# EAGLE schematic micromouse (EAGLE 9.6.2)
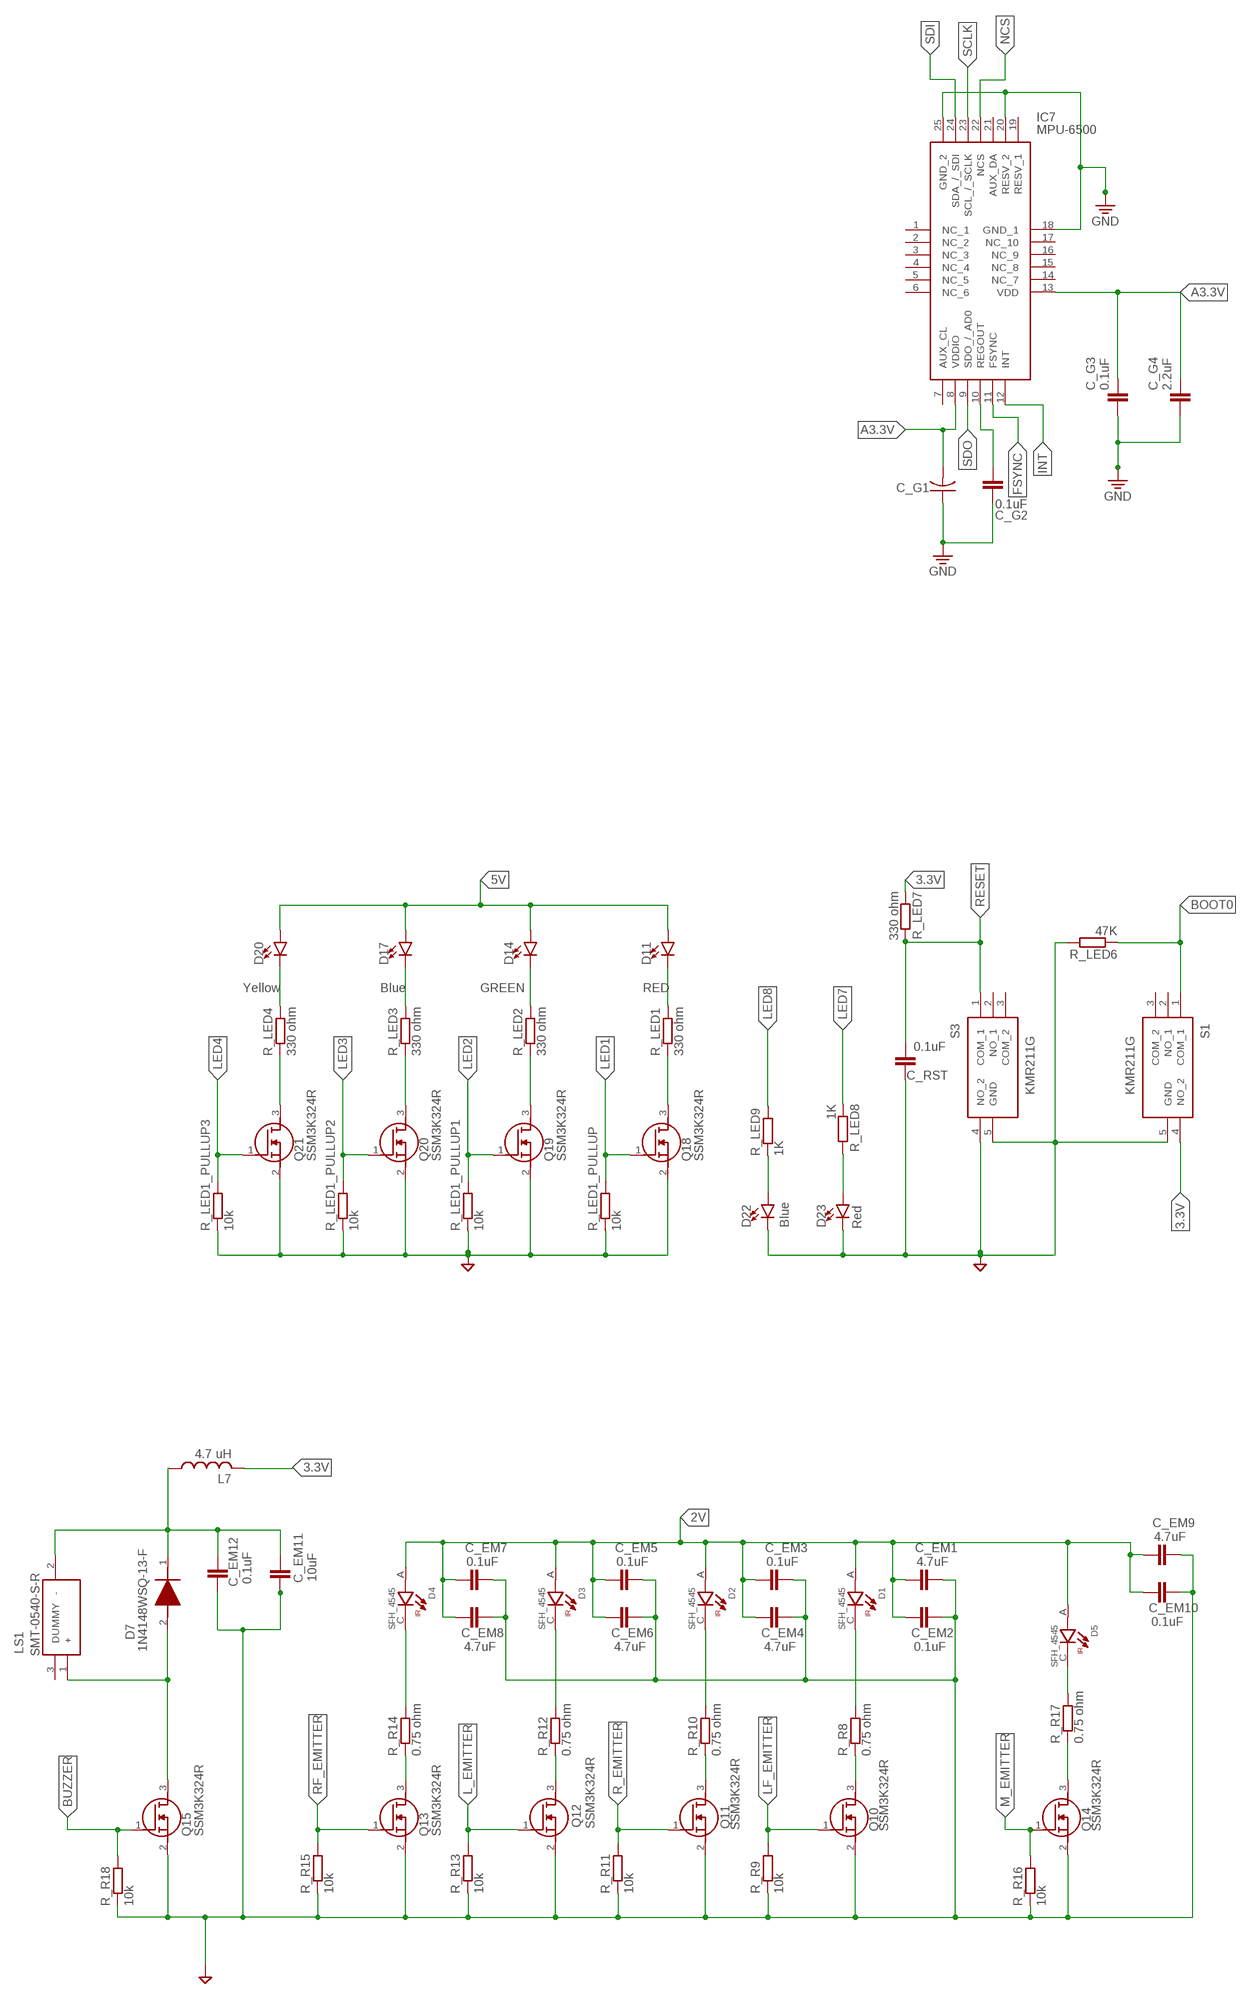
[diagram p0: schematic, sheet 1, part 1 of 2]
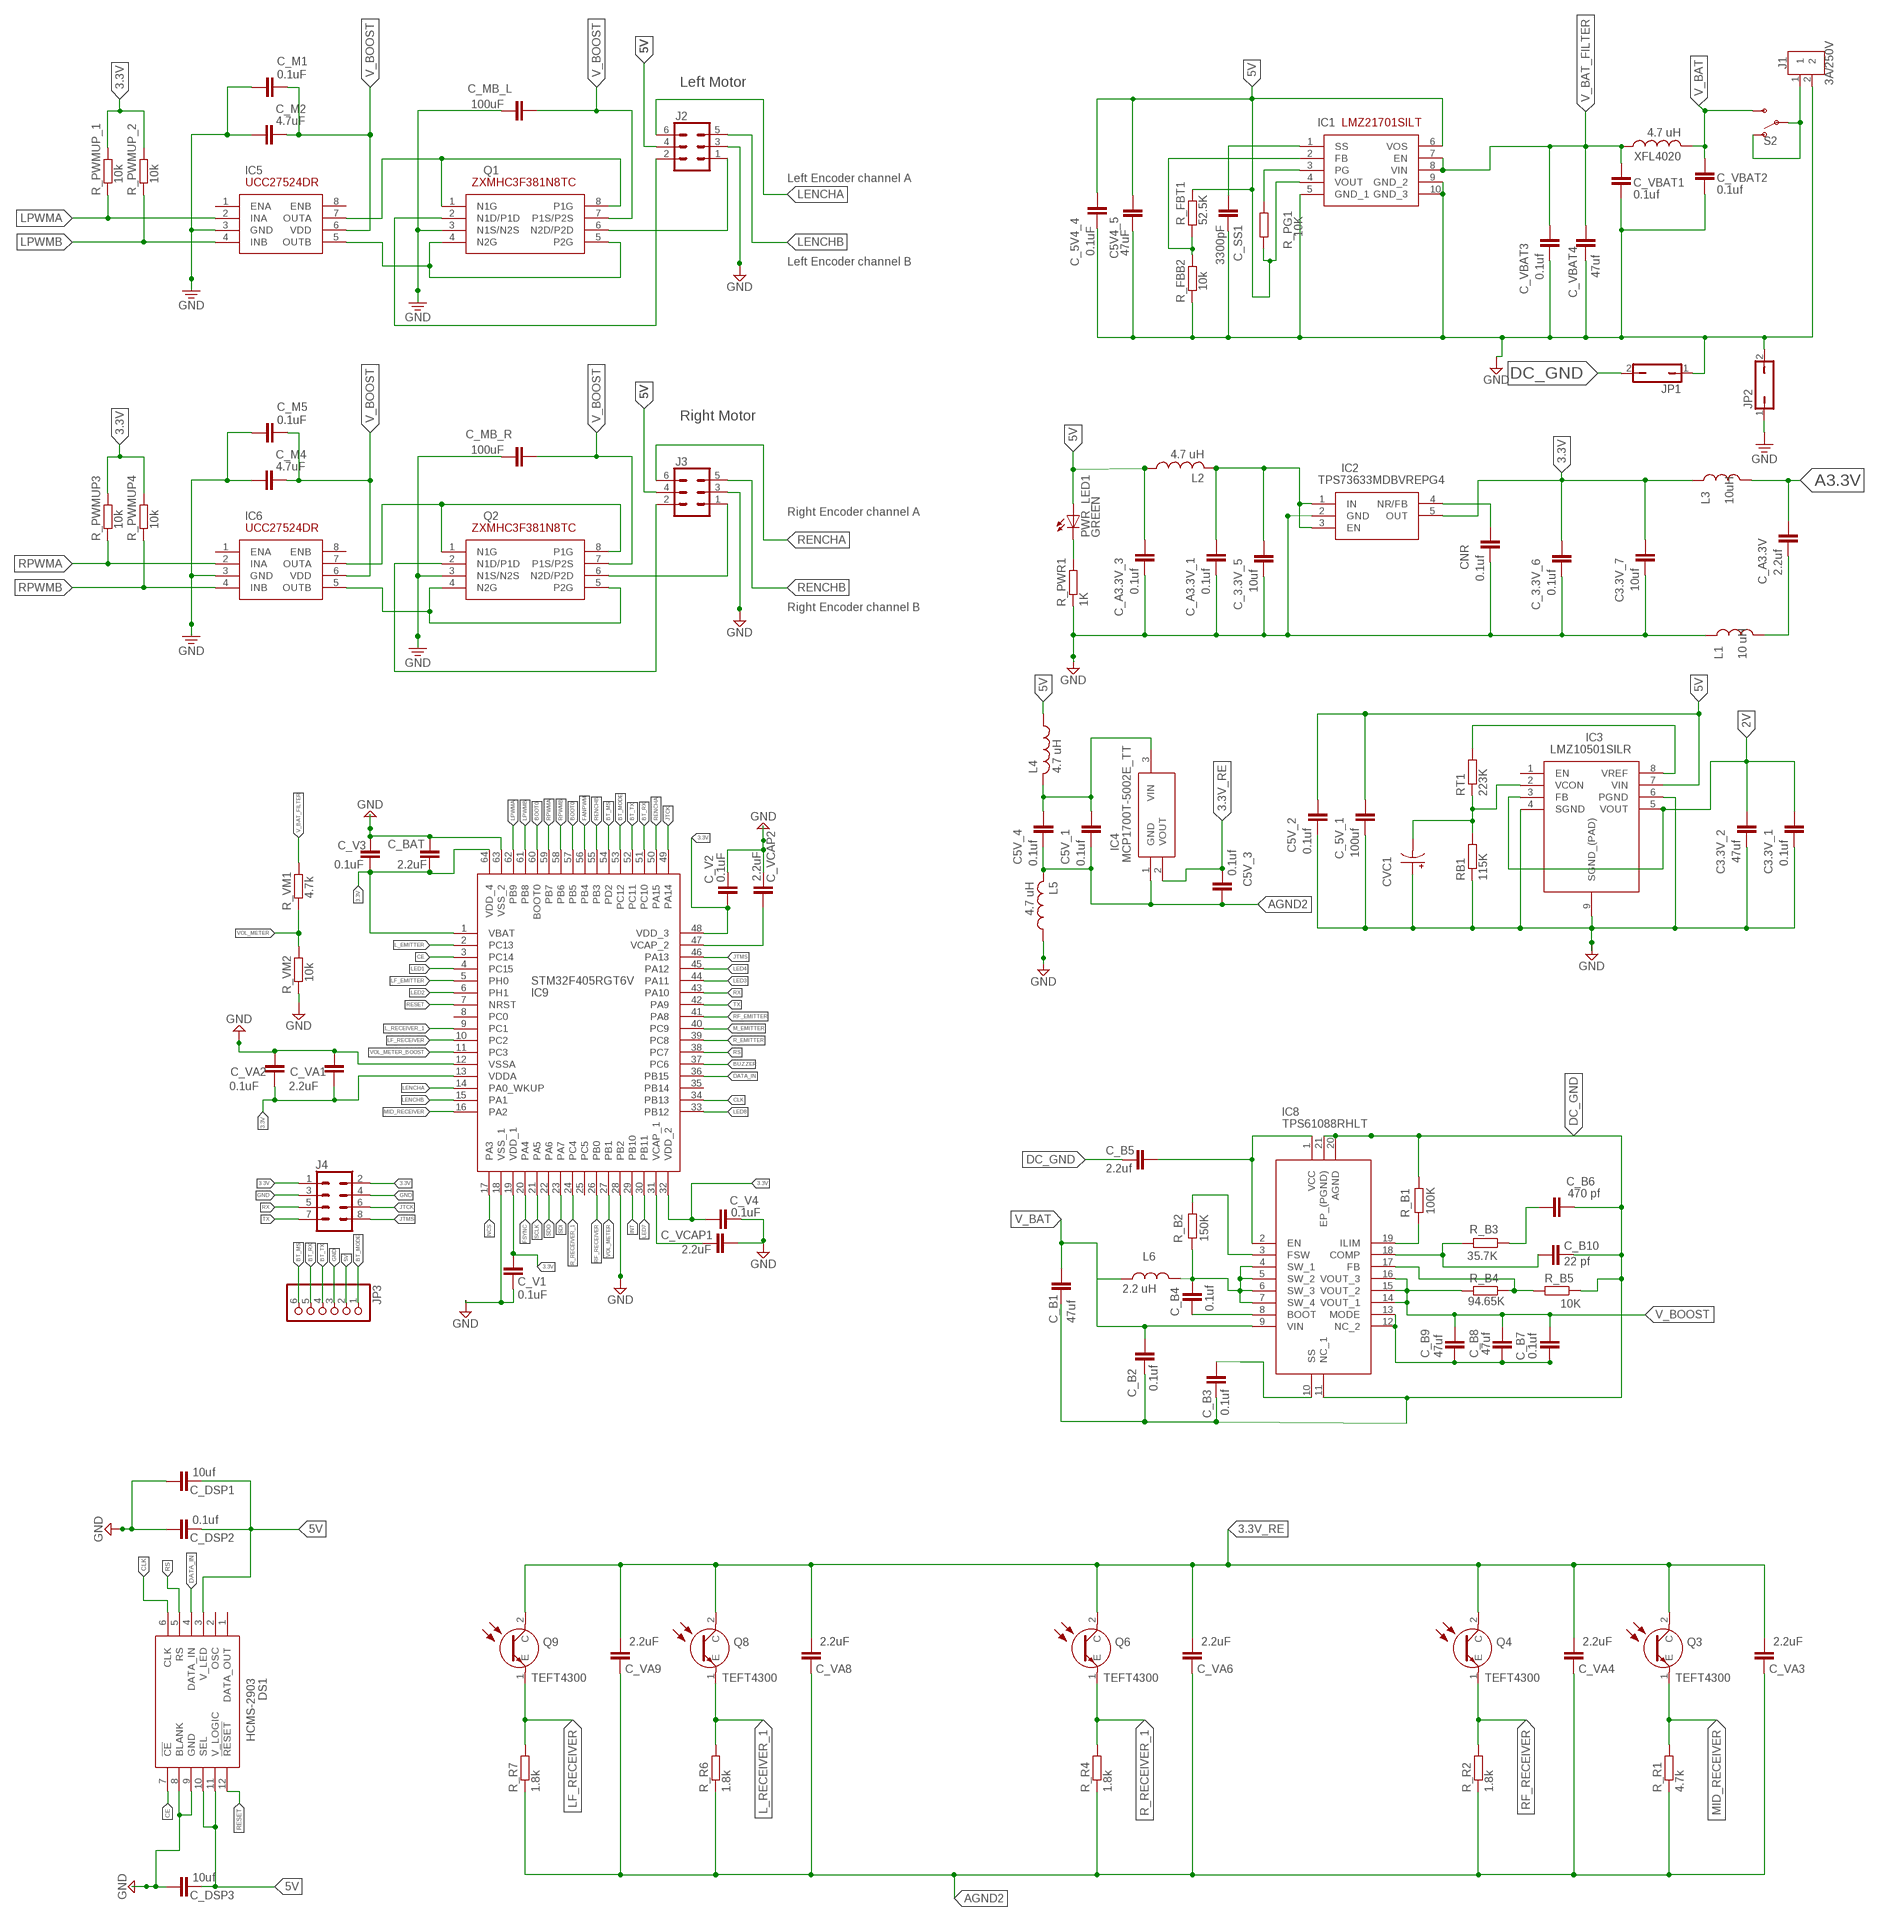
[diagram p1: schematic, sheet 1, part 2 of 2]

## Parts
C3.3V_1  0.1uf  C_CHIP-0805(2012-METRIC)  [CAPC2012X110]
C3.3V_2  47uf  C_CHIP-0805(2012-METRIC)  [CAPC2012X110]
C3.3V_7  10uf  C_CHIP-0805(2012-METRIC)  [CAPC2012X110]
C5V4_5  47uF  C_CHIP-0805(2012-METRIC)  [CAPC2012X110]
C5V_1  0.1uf  C_CHIP-0805(2012-METRIC)  [CAPC2012X110]
C5V_2  0.1uf  C_CHIP-0805(2012-METRIC)  [CAPC2012X110]
C5V_3  0.1uf  C_CHIP-0805(2012-METRIC)  [CAPC2012X110]
C5V_4  0.1uf  C_CHIP-0805(2012-METRIC)  [CAPC2012X110]
C_3.3V_5  10uf  C_CHIP-0805(2012-METRIC)  [CAPC2012X110]
C_3.3V_6  0.1uf  C_CHIP-0805(2012-METRIC)  [CAPC2012X110]
C_5V4_4  0.1uF  C_CHIP-0805(2012-METRIC)  [CAPC2012X110]
C_5V_1  100uf  C_CHIP-0805(2012-METRIC)  [CAPC2012X110]
C_A3.3V  2.2uf  C_CHIP-0805(2012-METRIC)  [CAPC2012X110]
C_A3.3V_1  0.1uf  C_CHIP-0805(2012-METRIC)  [CAPC2012X110]
C_A3.3V_3  0.1uf  C_CHIP-0805(2012-METRIC)  [CAPC2012X110]
C_B1  47uf  C_CHIP-0805(2012-METRIC)  [CAPC2012X110]
C_B2  0.1uf  C_CHIP-0805(2012-METRIC)  [CAPC2012X110]
C_B3  0.1uf  C_CHIP-0805(2012-METRIC)  [CAPC2012X110]
C_B4  0.1uf  C_CHIP-0805(2012-METRIC)  [CAPC2012X110]
C_B5  2.2uf  C_CHIP-0805(2012-METRIC)  [CAPC2012X110]
C_B6  470 pf  C_CHIP-0805(2012-METRIC)  [CAPC2012X110]
C_B7  0.1uf  C_CHIP-0805(2012-METRIC)  [CAPC2012X110]
C_B8  47uf  C_CHIP-0805(2012-METRIC)  [CAPC2012X110]
C_B9  47uf  C_CHIP-0805(2012-METRIC)  [CAPC2012X110]
C_B10  22 pf  C_CHIP-0805(2012-METRIC)  [CAPC2012X110]
C_BAT  2.2uF  C_CHIP-0805(2012-METRIC)  [CAPC2012X110]
C_DSP1  10uf  C_CHIP-0805(2012-METRIC)  [CAPC2012X110]
C_DSP2  0.1uf  C_CHIP-0805(2012-METRIC)  [CAPC2012X110]
C_DSP3  10uf  C_CHIP-0805(2012-METRIC)  [CAPC2012X110]
C_EM1  4.7uF  C_CHIP-0805(2012-METRIC)  [CAPC2012X110]
C_EM2  0.1uF  C_CHIP-0805(2012-METRIC)  [CAPC2012X110]
C_EM3  0.1uF  C_CHIP-0805(2012-METRIC)  [CAPC2012X110]
C_EM4  4.7uF  C_CHIP-0805(2012-METRIC)  [CAPC2012X110]
C_EM5  0.1uF  C_CHIP-0805(2012-METRIC)  [CAPC2012X110]
C_EM6  4.7uF  C_CHIP-0805(2012-METRIC)  [CAPC2012X110]
C_EM7  0.1uF  C_CHIP-0805(2012-METRIC)  [CAPC2012X110]
C_EM8  4.7uF  C_CHIP-0805(2012-METRIC)  [CAPC2012X110]
C_EM9  4.7uF  C_CHIP-0805(2012-METRIC)  [CAPC2012X110]
C_EM10  0.1uF  C_CHIP-0805(2012-METRIC)  [CAPC2012X110]
C_EM11  10uF  C_CHIP-0805(2012-METRIC)  [CAPC2012X110]
C_EM12  0.1uF  C_CHIP-0805(2012-METRIC)  [CAPC2012X110]
C_G1  0.01uF  C-USC0603K  [C0603K]
C_G2  0.1uF  C_CHIP-0805(2012-METRIC)  [CAPC2012X110]
C_G3  0.1uF  C_CHIP-0805(2012-METRIC)  [CAPC2012X110]
C_G4  2.2uF  C_CHIP-0805(2012-METRIC)  [CAPC2012X110]
C_M1  0.1uF  C_CHIP-0805(2012-METRIC)  [CAPC2012X110]
C_M2  4.7uF  C_CHIP-0805(2012-METRIC)  [CAPC2012X110]
C_M4  4.7uF  C_CHIP-0805(2012-METRIC)  [CAPC2012X110]
C_M5  0.1uF  C_CHIP-0805(2012-METRIC)  [CAPC2012X110]
C_MB_L  100uF  C_CHIP-0805(2012-METRIC)  [CAPC2012X110]
C_MB_R  100uF  C_CHIP-0805(2012-METRIC)  [CAPC2012X110]
C_RST  0.1uF  C_CHIP-0805(2012-METRIC)  [CAPC2012X110]
C_SS1  3300pF  C_CHIP-0805(2012-METRIC)  [CAPC2012X110]
C_V1  0.1uF  C_CHIP-0805(2012-METRIC)  [CAPC2012X110]
C_V2  0.1uF  C_CHIP-0805(2012-METRIC)  [CAPC2012X110]
C_V3  0.1uF  C_CHIP-0805(2012-METRIC)  [CAPC2012X110]
C_V4  0.1uF  C_CHIP-0805(2012-METRIC)  [CAPC2012X110]
C_VA1  2.2uF  C_CHIP-0805(2012-METRIC)  [CAPC2012X110]
C_VA2  0.1uF  C_CHIP-0805(2012-METRIC)  [CAPC2012X110]
C_VA3  2.2uF  C_CHIP-0805(2012-METRIC)  [CAPC2012X110]
C_VA4  2.2uF  C_CHIP-0805(2012-METRIC)  [CAPC2012X110]
C_VA6  2.2uF  C_CHIP-0805(2012-METRIC)  [CAPC2012X110]
C_VA8  2.2uF  C_CHIP-0805(2012-METRIC)  [CAPC2012X110]
C_VA9  2.2uF  C_CHIP-0805(2012-METRIC)  [CAPC2012X110]
C_VBAT1  0.1uf  C_CHIP-0805(2012-METRIC)  [CAPC2012X110]
C_VBAT2  0.1uf  C_CHIP-0805(2012-METRIC)  [CAPC2012X110]
C_VBAT3  0.1uf  C_CHIP-0805(2012-METRIC)  [CAPC2012X110]
C_VBAT4  47uf  C_CHIP-0805(2012-METRIC)  [CAPC2012X110]
C_VCAP1  2.2uF  C_CHIP-0805(2012-METRIC)  [CAPC2012X110]
C_VCAP2  2.2uF  C_CHIP-0805(2012-METRIC)  [CAPC2012X110]
CNR  0.1uf  C_CHIP-0805(2012-METRIC)  [CAPC2012X110]
CVC1  470uf  CPOL-USCT3528  [CT3528]
D1  SFH_4545  [DIO_SFH_4545]
D2  SFH_4545  [DIO_SFH_4545]
D3  SFH_4545  [DIO_SFH_4545]
D4  SFH_4545  [DIO_SFH_4545]
D5  SFH_4545  [DIO_SFH_4545]
D7  1N4148WSQ-13-F  [SOD2513X120N]
D11  LED0603  [LED-0603]
D14  LED0603  [LED-0603]
D17  LED0603  [LED-0603]
D20  LED0603  [LED-0603]
D22  LED0603  [LED-0603]
D23  LED0603  [LED-0603]
DS1  HCMS-2903  [DIPS762W64P254L1778H508Q12N]
IC1  LMZ21701SILT  [LMZ21701SILT]
IC2  TPS73633MDBVREPG4  [SOT95P280X145-5N]
IC3  LMZ10501SILR  [SON65P260X300X150-9N]
IC4  MCP1700T-5002E_TT  [SOT95P237X112-3N]
IC5  UCC27524DR  [SOIC127P600X175-8N]
IC6  UCC27524DR  [SOIC127P600X175-8N]
IC7  MPU-6500  [QFN40P300X300X95-25N]
IC8  TPS61088RHLT  [BQ24031IRHLRQ1]
IC9  STM32F405RGT6V  [QFP50P1200X1200X160-64N]
J1  3A/250V  B2B-XH-A  [B2B-XH-A]
J2  MA03-2  [MA03-2]
J3  MA03-2  [MA03-2]
J4  CONN_04X2  [2X4]
JP1  JP1Q  [JP1]
JP2  JP1Q  [JP1]
JP3  PINHD-1X6  [1X06]
L1  10 uH  L_CHIP-0805(2012-METRIC)  [INDC2009X120]
L2  4.7 uH  L-USL4035M  [L4035M]
L3  10uH  L_CHIP-0805(2012-METRIC)  [INDC2009X120]
L4  4.7 uH  L-USL4035M  [L4035M]
L5  4.7 uH  L-USL4035M  [L4035M]
L6  2.2 uH  L_CHIP-0805(2012-METRIC)  [INDC2009X120]
L7  4.7 uH  L-USL4035M  [L4035M]
LS1  SMT-0540-S-R  [SMT0540SR]
PWR_LED1  GREEN  LEDCHIPLED_0603  [CHIPLED_0603]
Q1  ZXMHC3F381N8TC  [SOIC127P600X175-8N]
Q2  ZXMHC3F381N8TC  [SOIC127P600X175-8N]
Q3  TEFT4300  [TEFT4300]
Q4  TEFT4300  [TEFT4300]
Q6  TEFT4300  [TEFT4300]
Q8  TEFT4300  [TEFT4300]
Q9  TEFT4300  [TEFT4300]
Q10  SSM3K324R  [SOT95P240X88-3N]
Q11  SSM3K324R  [SOT95P240X88-3N]
Q12  SSM3K324R  [SOT95P240X88-3N]
Q13  SSM3K324R  [SOT95P240X88-3N]
Q14  SSM3K324R  [SOT95P240X88-3N]
Q15  SSM3K324R  [SOT95P240X88-3N]
Q18  SSM3K324R  [SOT95P240X88-3N]
Q19  SSM3K324R  [SOT95P240X88-3N]
Q20  SSM3K324R  [SOT95P240X88-3N]
Q21  SSM3K324R  [SOT95P240X88-3N]
R_B1  100K  R_CHIP-0603(1608-METRIC)  [RESC1608X60]
R_B2  150K  R_CHIP-0603(1608-METRIC)  [RESC1608X60]
R_B3  35.7K  R_CHIP-0603(1608-METRIC)  [RESC1608X60]
R_B4  94.65K  R_CHIP-0603(1608-METRIC)  [RESC1608X60]
R_B5  10K  R_CHIP-0603(1608-METRIC)  [RESC1608X60]
R_FBB2  10k  R_CHIP-0603(1608-METRIC)  [RESC1608X60]
R_FBT1  52.5K  R_CHIP-0603(1608-METRIC)  [RESC1608X60]
R_LED1  330 ohm  R_CHIP-0603(1608-METRIC)  [RESC1608X60]
R_LED1_PULLUP  10k  R_CHIP-0603(1608-METRIC)  [RESC1608X60]
R_LED1_PULLUP1  10k  R_CHIP-0603(1608-METRIC)  [RESC1608X60]
R_LED1_PULLUP2  10k  R_CHIP-0603(1608-METRIC)  [RESC1608X60]
R_LED1_PULLUP3  10k  R_CHIP-0603(1608-METRIC)  [RESC1608X60]
R_LED2  330 ohm  R_CHIP-0603(1608-METRIC)  [RESC1608X60]
R_LED3  330 ohm  R_CHIP-0603(1608-METRIC)  [RESC1608X60]
R_LED4  330 ohm  R_CHIP-0603(1608-METRIC)  [RESC1608X60]
R_LED6  47K  R_CHIP-0603(1608-METRIC)  [RESC1608X60]
R_LED7  330 ohm  R_CHIP-0603(1608-METRIC)  [RESC1608X60]
R_LED8  1K  R_CHIP-0603(1608-METRIC)  [RESC1608X60]
R_LED9  1K  R_CHIP-0603(1608-METRIC)  [RESC1608X60]
R_PG1  10K  R_CHIP-0603(1608-METRIC)  [RESC1608X60]
R_PWMUP3  10k  R_CHIP-0603(1608-METRIC)  [RESC1608X60]
R_PWMUP4  10k  R_CHIP-0603(1608-METRIC)  [RESC1608X60]
R_PWMUP_1  10k  R_CHIP-0603(1608-METRIC)  [RESC1608X60]
R_PWMUP_2  10k  R_CHIP-0603(1608-METRIC)  [RESC1608X60]
R_PWR1  1K  R_CHIP-0603(1608-METRIC)  [RESC1608X60]
R_R1  4.7k  R_CHIP-0603(1608-METRIC)  [RESC1608X60]
R_R2  1.8k  R_CHIP-0603(1608-METRIC)  [RESC1608X60]
R_R4  1.8k  R_CHIP-0603(1608-METRIC)  [RESC1608X60]
R_R6  1.8k  R_CHIP-0603(1608-METRIC)  [RESC1608X60]
R_R7  1.8k  R_CHIP-0603(1608-METRIC)  [RESC1608X60]
R_R8  0.75 ohm  R_CHIP-0603(1608-METRIC)  [RESC1608X60]
R_R9  10k  R_CHIP-0603(1608-METRIC)  [RESC1608X60]
R_R10  0.75 ohm  R_CHIP-0603(1608-METRIC)  [RESC1608X60]
R_R11  10k  R_CHIP-0603(1608-METRIC)  [RESC1608X60]
R_R12  0.75 ohm  R_CHIP-0603(1608-METRIC)  [RESC1608X60]
R_R13  10k  R_CHIP-0603(1608-METRIC)  [RESC1608X60]
R_R14  0.75 ohm  R_CHIP-0603(1608-METRIC)  [RESC1608X60]
R_R15  10k  R_CHIP-0603(1608-METRIC)  [RESC1608X60]
R_R16  10k  R_CHIP-0603(1608-METRIC)  [RESC1608X60]
R_R17  0.75 ohm  R_CHIP-0603(1608-METRIC)  [RESC1608X60]
R_R18  10k  R_CHIP-0603(1608-METRIC)  [RESC1608X60]
R_VM1  4.7k  R_CHIP-0603(1608-METRIC)  [RESC1608X60]
R_VM2  10k  R_CHIP-0603(1608-METRIC)  [RESC1608X60]
RB1  115K  R_CHIP-0603(1608-METRIC)  [RESC1608X60]
RT1  223K  R-EU_R0805  [R0805]
S1  KMR211G  [KMR211G]
S2  SWITCH-SPDT-PTH-11.6X4.0MM  [SWITCH_SPDT_PTH_11.6X4.0MM]
S3  KMR211G  [KMR211G]
XFL4020  4.7 uH  L-USL4035M  [L4035M]

## Nets
2V: C3.3V_1.2 C3.3V_2.2 C_EM1.1 C_EM2.1 C_EM3.1 C_EM4.1 C_EM5.1 C_EM6.1 C_EM7.1 C_EM8.1 C_EM9.1 C_EM10.1 D1.A D2.A D3.A D4.A D5.A IC3.3(FB) IC3.5(VOUT)
3.3V: C3.3V_7.2 C_3.3V_6.2 C_BAT.1 C_V1.2 C_V2.1 C_V3.1 C_V4.1 C_VA1.1 C_VA2.1 IC2.5(OUT) IC9.1(VBAT) IC9.13(VDDA) IC9.19(VDD_1) IC9.32(VDD_2) IC9.48(VDD_3) IC9.64(VDD_4) J4.1 J4.2 L3.1 L7.2 R_LED7.1 R_PWMUP3.2 R_PWMUP4.2 R_PWMUP_1.2 R_PWMUP_2.2 S1.4(NO_2)
3.3V_RE: C5V_3.1 C_VA3.1 C_VA4.1 C_VA6.1 C_VA8.1 C_VA9.1 IC4.2(VOUT) Q3.2(C) Q4.2(C) Q6.2(C) Q8.2(C) Q9.2(C)
5V: C5V4_5.1 C5V_2.2 C_5V4_4.2 C_5V_1.2 C_A3.3V_3.2 C_DSP1.1 C_DSP2.1 C_DSP3.1 D11.A D14.A D17.A D20.A DS1.3(V_LED) DS1.10(SEL) DS1.11(V_LOGIC) IC1.4(VOUT) IC1.6(VOS) IC3.7(VIN) J2.4 J3.4 JP3.2 L2.1 L4.1 PWR_LED1.A R_FBT1.2 R_PG1.1
A3.3V: C_A3.3V.2 C_G1.2 C_G3.1 C_G4.1 IC7.8(VDDIO) IC7.13(VDD) L3.2
AGND2: C5V_1.1 C5V_3.2 C5V_4.1 C_VA3.2 C_VA4.2 C_VA6.2 C_VA8.2 C_VA9.2 IC4.1(GND) L5.2 R_R1.1 R_R2.1 R_R4.1 R_R6.1 R_R7.1
BOOT0: IC9.57(PB5) IC9.60(BOOT0) R_LED6.1 S1.1(COM_1)
BT_MODE: IC9.53(PC12) JP3.1
BT_MS: IC9.54(PD2) JP3.6
BT_RX: IC9.51(PC10) JP3.5
BT_TX: IC9.52(PC11) JP3.4
BUZZER: IC9.37(PC6) Q15.1(G) R_R18.2
CE: DS1.7(!CE) IC9.3(PC14)
CLK: DS1.6(CLK) IC9.34(PB13)
DATA_IN: DS1.4(DATA_IN) IC9.36(PB15)
DC_GND: C_B1.2 C_B2.2 C_B3.1 C_B5.1 C_B6.1 C_B10.1 IC8.11(NC_1) IC8.20(AGND) IC8.21(EP_(PGND)) JP1.2 R_B1.1 R_B5.1
FANPWM: IC9.56(PB4)
FSYNC: IC7.11(FSYNC) IC9.20(PA4)
GND: C3.3V_1.1 C3.3V_2.1 C3.3V_7.1 C5V4_5.2 C5V_2.1 C_3.3V_5.1 C_3.3V_6.1 C_5V4_4.1 C_5V_1.1 C_A3.3V_1.1 C_A3.3V_3.1 C_BAT.2 C_DSP1.2 C_DSP2.2 C_DSP3.2 C_EM1.2 C_EM2.2 C_EM3.2 C_EM4.2 C_EM5.2 C_EM6.2 C_EM7.2 C_EM8.2 C_EM9.2 C_EM10.2 C_EM11.2 C_EM12.1 C_M1.2 C_M2.1 C_M4.1 C_M5.2 C_MB_L.1 C_MB_R.1 C_RST.2 C_SS1.1 C_V1.1 C_V2.2 C_V3.2 C_V4.2 C_VA1.2 C_VA2.2 C_VBAT1.2 C_VBAT2.2 C_VBAT3.1 C_VBAT4.1 C_VCAP1.1 C_VCAP2.2 CNR.1 CVC1.+ D22.C D23.C DS1.8(BLANK) DS1.9(GND) IC1.5(GND_1) IC1.9(GND_2) IC1.10(GND_3) IC2.2(GND) IC3.4(SGND) IC3.6(PGND) IC3.9(SGND_(PAD)) IC5.3(GND) IC6.3(GND) IC9.12(VSSA) IC9.18(VSS_1) IC9.28(PB2) IC9.63(VSS_2) J1.2 J2.3 J3.3 J4.3 J4.4 JP1.1 JP2.1 JP2.2 JP3.3 L1.1 L5.1 Q1.3(N1S/N2S) Q2.3(N1S/N2S) Q10.2(S) Q11.2(S) Q12.2(S) Q13.2(S) Q14.2(S) Q15.2(S) Q18.2(S) Q19.2(S) Q20.2(S) Q21.2(S) R_FBB2.1 R_LED1_PULLUP1.1 R_LED1_PULLUP2.1 R_LED1_PULLUP3.1 R_LED1_PULLUP.1 R_LED6.2 R_PWR1.1 R_R9.1 R_R11.1 R_R13.1 R_R15.1 R_R16.1 R_R18.1 R_VM2.1 RB1.1 S1.5(GND) S3.4(NO_2) S3.5(GND)
INT: IC7.12(INT) IC9.29(PB10)
JTCK: IC9.49(PA14) J4.6
JTMS: IC9.46(PA13) J4.8
L_EMITTER: IC9.2(PC13) Q12.1(G) R_R13.2
L_RECEIVER_1: IC9.9(PC1) Q8.1(E) R_R6.2
LED1: IC9.4(PC15) Q18.1(G) R_LED1_PULLUP.2
LED2: IC9.6(PH1) Q19.1(G) R_LED1_PULLUP1.2
LED3: IC9.44(PA11) Q20.1(G) R_LED1_PULLUP2.2
LED4: IC9.45(PA12) Q21.1(G) R_LED1_PULLUP3.2
LED7: IC9.30(PB11) R_LED8.1
LED8: IC9.33(PB12) R_LED9.2
LENCHA: IC9.14(PA0_WKUP) J2.6
LENCHB: IC9.15(PA1) J2.5
LF_EMITTER: IC9.5(PH0) Q10.1(G) R_R9.2
LF_RECEIVER: IC9.10(PC2) Q9.1(E) R_R7.2
LPWMA: IC5.2(INA) IC9.62(PB9) R_PWMUP_1.1
LPWMB: IC5.4(INB) IC9.61(PB8) R_PWMUP_2.1
M_EMITTER: IC9.40(PC9) Q14.1(G) R_R16.2
MID_RECEIVER: IC9.16(PA2) Q3.1(E) R_R1.2
N$1: C_SS1.2 IC1.1(SS)
N$2: IC5.7(OUTA) Q1.1(N1G) Q1.8(P1G)
N$3: IC1.3(PG) R_PG1.2
N$4: C_3.3V_5.2 C_A3.3V_1.2 IC2.1(IN) IC2.3(EN) L2.2
N$5: IC3.8(VREF) RT1.2
N$6: PWR_LED1.C R_PWR1.2
N$7: IC1.2(FB) R_FBB2.2 R_FBT1.1
N$8: CVC1.- IC3.2(VCON) RB1.2 RT1.1
N$9: J1.1 S2.1(O) S2.2(P)
N$10: CNR.2 IC2.4(NR/FB)
N$11: IC6.7(OUTA) Q2.1(N1G) Q2.8(P1G)
N$12: C5V_1.2 C5V_4.2 IC4.3(VIN) L4.2
N$13: C_A3.3V.1 L1.2
N$14: IC6.5(OUTB) Q2.4(N2G) Q2.5(P2G)
N$15: IC5.5(OUTB) Q1.4(N2G) Q1.5(P2G)
N$16: J3.2 Q2.2(N1D/P1D)
N$17: J2.2 Q1.2(N1D/P1D)
N$18: J2.1 Q1.6(N2D/P2D)
N$19: J3.1 Q2.6(N2D/P2D)
N$20: IC7.18(GND_1) IC7.20(RESV_2) IC7.25(GND_2)
N$21: C_G3.2 C_G4.2
N$22: C_G2.1 IC7.10(REGOUT)
N$24: C_G1.1 C_G2.2
N$25: C_B3.2 IC8.10(SS)
N$26: C_B4.2 IC8.8(BOOT)
N$27: D1.C R_R8.2
N$28: C_B4.1 IC8.4(SW_1) IC8.5(SW_2) IC8.6(SW_3) IC8.7(SW_4) L6.2 R_B2.1
N$29: IC8.19(ILIM) R_B1.2
N$30: C_B10.2 IC8.18(COMP) R_B3.2
N$31: IC8.3(FSW) R_B2.2
N$32: C_B5.2 IC8.1(VCC) IC8.2(EN)
N$33: Q10.3(D) R_R8.1
N$34: C_B6.2 R_B3.1
N$35: IC8.17(FB) R_B4.1 R_B5.2
N$37: Q14.3(D) R_R17.1
N$38: C_B7.2 C_B8.2 C_B9.2 IC8.12(NC_2) IC8.13(MODE)
N$39: D5.C R_R17.2
N$40: D2.C R_R10.2
N$41: Q11.3(D) R_R10.1
N$43: D7.2(A) LS1.1(+) Q15.3(D)
N$44: C_EM11.1 C_EM12.2 D7.1(K) L7.1 LS1.2(-)
N$45: D3.C R_R12.2
N$46: Q12.3(D) R_R12.1
N$48: C_VCAP2.1 IC9.47(VCAP_2)
N$51: D4.C R_R14.2
N$52: Q13.3(D) R_R14.1
N$53: C_VCAP1.2 IC9.31(VCAP_1)
N$63: Q18.3(D) R_LED1.1
N$64: D11.C R_LED1.2
N$66: Q19.3(D) R_LED2.1
N$67: D14.C R_LED2.2
N$69: D22.A R_LED9.1
N$70: Q20.3(D) R_LED3.1
N$71: D17.C R_LED3.2
N$72: D23.A R_LED8.2
N$74: Q21.3(D) R_LED4.1
N$75: D20.C R_LED4.2
NCS: IC7.22(NCS) IC9.17(PA3)
R_EMITTER: IC9.39(PC8) Q11.1(G) R_R11.2
R_RECEIVER_1: IC9.24(PC4) Q6.1(E) R_R4.2
RENCHA: IC9.50(PA15) J3.6
RENCHB: IC9.55(PB3) J3.5
RESET: C_RST.1 DS1.12(!RESET) IC9.7(NRST) R_LED7.2 S3.1(COM_1)
RF_EMITTER: IC9.41(PA8) Q13.1(G) R_R15.2
RF_RECEIVER: IC9.26(PB0) Q4.1(E) R_R2.2
RPWMA: IC6.2(INA) IC9.59(PB7) R_PWMUP3.1
RPWMB: IC6.4(INB) IC9.58(PB6) R_PWMUP4.1
RS: DS1.5(RS) IC9.38(PC7)
RX: IC9.43(PA10) J4.5
SCLK: IC7.23(SCL_/_SCLK) IC9.21(PA5)
SDI: IC7.24(SDA_/_SDI) IC9.23(PA7)
SDO: IC7.9(SDO_/_AD0) IC9.22(PA6)
TX: IC9.42(PA9) J4.7
V_BAT: C_B1.1 C_B2.1 C_VBAT2.1 IC8.9(VIN) L6.1 S2.3(S) XFL4020.2
V_BAT_FILTER: C_VBAT1.1 C_VBAT3.2 C_VBAT4.2 IC1.7(EN) IC1.8(VIN) R_VM1.2 XFL4020.1
V_BOOST: C_B7.1 C_B8.1 C_B9.1 C_M1.1 C_M2.2 C_M4.2 C_M5.1 C_MB_L.2 C_MB_R.2 IC5.6(VDD) IC6.6(VDD) IC8.14(VOUT_1) IC8.15(VOUT_2) IC8.16(VOUT_3) Q1.7(P1S/P2S) Q2.7(P1S/P2S) R_B4.2
VOL_METER: IC9.27(PB1) R_VM1.1 R_VM2.2
VOL_METER_BOOST: IC9.11(PC3)
Unconnected: DS1.1(DATA_OUT) DS1.2(OSC) IC3.1(EN) IC5.1(ENA) IC5.8(ENB) IC6.1(ENA) IC6.8(ENB) IC7.1(NC_1) IC7.2(NC_2) IC7.3(NC_3) IC7.4(NC_4) IC7.5(NC_5) IC7.6(NC_6) IC7.7(AUX_CL) IC7.14(NC_7) IC7.15(NC_8) IC7.16(NC_9) IC7.17(NC_10) IC7.19(RESV_1) IC7.21(AUX_DA) IC9.8(PC0) IC9.25(PC5) IC9.35(PB14) LS1.3(DUMMY) S1.2(NO_1) S1.3(COM_2) S3.2(NO_1) S3.3(COM_2)

## Notes on the sheet
- Left Motor
- Left Encoder channel A
- Left Encoder channel B
- Right Motor
- Right Encoder channel A
- Right Encoder channel B
- Yellow | Blue | GREEN | RED
- Blue | Red

## Library data of the parts
C3.3V_1 C3.3V_2 C3.3V_7 C5V4_5 C5V_1-C5V_4 C_3.3V_5 C_3.3V_6 C_5V4_4 C_5V_1 C_A3.3V C_A3.3V_1 C_A3.3V_3 C_B1-C_B10 C_BAT C_DSP1-C_DSP3 C_EM1-C_EM12 C_G2-C_G4 C_M1 C_M2 C_M4 C_M5 C_MB_L C_MB_R C_RST C_SS1 C_V1-C_V4 C_VA1-C_VA4 C_VA6 C_VA8 C_VA9 C_VBAT1-C_VBAT4 C_VCAP1 C_VCAP2 CNR = Tutorial - Fusion 360:C: Capacitor - Generic; CATEGORY: Capacitor
C_G1 = rcl:C-US: CAPACITOR, American symbol; SPICEPREFIX: C
CVC1 = rcl:CPOL-US: POLARIZED CAPACITOR, American symbol; SPICEPREFIX: C
D1-D5 = SFH_4545:SFH_4545: High Power Infrared Emitter (940 nm) Check availability <https://pricing.snapeda.com/parts/SFH%204545/OSRAM%20Opto/view-part?ref=eda>; AVAILABILITY: In Stock; DESCRIPTION: Infrared (IR) Emitter 950nm 1.5V 100mA 550mW/sr @ 100mA 10° Radial; MF: OSRAM Opto; MP: SFH 4545; PACKAGE: Radial Osram Opto; PRICE: None
D7 = SamacSys_Parts:1N4148WSQ-13-F: SURFACE MOUNT FAST SWITCHING DIODE Source: Datasheet <https://www.diodes.com/assets/Datasheets/ds30097.pdf>; ARROW_PART_NUMBER: 1N4148WSQ-13-F; ARROW_PRICE-STOCK: https://www.arrow.com/en/products/1n4148wsq-13-f/diodes-incorporated; DESCRIPTION: SURFACE MOUNT FAST SWITCHING DIODE; HEIGHT: 1.2mm; MANUFACTURER_NAME: Diodes Inc.; MANUFACTURER_PART_NUMBER: 1N4148WSQ-13-F; MOUSER_PART_NUMBER: N/A; MOUSER_PRICE-STOCK: https://www.mouser.com/Search/Refine.aspx?Keyword=N%2FA
D11 D14 D17 D20 D22 D23 = SparkFun-LED:LED: LED (Generic) Standard schematic elements and footprints for 5mm, 3mm, 1206, and 0603 sized LEDs. Generic LEDs with no color specified.
DS1 = SamacSys_Parts:HCMS-2903: HCMS-2903 Avago 4 Digit Alphanumeric LED Display, 7 x 5 Dot Matrix Green 114 ucd 3.7mm Source: Datasheet <https://eu.mouser.com/datasheet/2/678/av02-0699en_ds_hcms-29xx_2015-10-15-1827686.pdf>; DESCRIPTION: HCMS-2903 Avago 4 Digit Alphanumeric LED Display, 7 x 5 Dot Matrix Green 114 ucd 3.7mm; HEIGHT: 5.08mm; MANUFACTURER_NAME: Avago Technologies; MANUFACTURER_PART_NUMBER: HCMS-2903; MOUSER_PART_NUMBER: 630-HCMS-2903; MOUSER_PRICE-STOCK: https://www.mouser.co.uk/ProductDetail/Broadcom-Avago/HCMS-2903?qs=xnajaXqBF98aIaDe8yGItA%3D%3D
IC1 = LMZ21701SILT:LMZ21701SILT: 3V to 17V, 1A Step-Down DC/DC Power Module in 3.5mm 3.5mm Package Source: Datasheet <http://www.ti.com/lit/gpn/lmz21701>; ARROW_PART_NUMBER: LMZ21701SILT; ARROW_PRICE-STOCK: https://www.arrow.com/en/products/lmz21701silt/texas-instruments?region=nac; DESCRIPTION: 3V to 17V, 1A Step-Down DC/DC Power Module in 3.5mm 3.5mm Package; HEIGHT: 1.75mm; MANUFACTURER_NAME: Texas Instruments; MANUFACTURER_PART_NUMBER: LMZ21701SILT; MOUSER_PART_NUMBER: 595-LMZ21701SILT; MOUSER_PRICE-STOCK: https://www.mouser.co.uk/ProductDetail/Texas-Instruments/LMZ21701SILT?qs=%2Fd%252BFzHvH4c3T8wa09brf8Q%3D%3D; SPICEPREFIX: X
IC2 = TPS73633MDBVREPG4:TPS73633MDBVREPG4: LOW-DROPOUT REGULATORS Source: Datasheet <http://www.ti.com/lit/ds/symlink/tps73633-ep.pdf>; ARROW_PART_NUMBER: TPS73633MDBVREPG4; ARROW_PRICE-STOCK: https://www.arrow.com/en/products/tps73633mdbvrepg4/texas-instruments; DESCRIPTION: LOW-DROPOUT REGULATORS; HEIGHT: 1.45mm; MANUFACTURER_NAME: Texas Instruments; MANUFACTURER_PART_NUMBER: TPS73633MDBVREPG4; MOUSER_PART_NUMBER: 595-PS73633MDBVREPG4; MOUSER_PRICE-STOCK: https://www.mouser.co.uk/ProductDetail/Texas-Instruments/TPS73633MDBVREPG4?qs=OaSNdy%2FNfzkIGdo0ZU34AA%3D%3D; SPICEPREFIX: X
IC3 = LMZ10501SILR:LMZ10501SILR: Non-Isolated DC/DC Converters 1A Nano Mod w/ 5.5V Max Inpt VTG Source: Datasheet <http://www.ti.com/lit/ds/symlink/lmz10501.pdf>; ARROW_PART_NUMBER: LMZ10501SILR; ARROW_PRICE-STOCK: https://www.arrow.com/en/products/lmz10501silr/texas-instruments; DESCRIPTION: Non-Isolated DC/DC Converters 1A Nano Mod w/ 5.5V Max Inpt VTG; HEIGHT: 1.5mm; MANUFACTURER_NAME: Texas Instruments; MANUFACTURER_PART_NUMBER: LMZ10501SILR; MOUSER_PART_NUMBER: 595-LMZ10501SILR; MOUSER_PRICE-STOCK: https://www.mouser.co.uk/ProductDetail/Texas-Instruments/LMZ10501SILR?qs=wqe5ZXqX%252B99mwpjk8%252BrPBA%3D%3D; SPICEPREFIX: X
IC4 = MCP1700T-5002E_TT:MCP1700T-5002E_TT: LDO Regulator 250mA 5.0V 1.6uA SOT23 Source: Datasheet <https://datasheet.datasheetarchive.com/originals/distributors/SFDatasheet-4/sf-00090030.pdf>; ARROW_PART_NUMBER: MCP1700T-5002E/TT; ARROW_PRICE-STOCK: https://www.arrow.com/en/products/mcp1700t-5002ett/microchip-technology?region=nac; DESCRIPTION: LDO Regulator 250mA 5.0V 1.6uA SOT23; HEIGHT: 1.12mm; MANUFACTURER_NAME: Microchip; MANUFACTURER_PART_NUMBER: MCP1700T-5002E/TT; MOUSER_PART_NUMBER: 579-MCP1700T5002E/TT; MOUSER_PRICE-STOCK: https://www.mouser.co.uk/ProductDetail/Microchip-Technology-Atmel/MCP1700T-5002E-TT?qs=fM4xO01eazNr4AnStMRB%2Fg%3D%3D; SPICEPREFIX: J
IC5 IC6 = UCC27524DR:UCC27524DR: Dual, 5A, High-Speed Low-Side Power MOSFET Driver Source: Datasheet <http://www.ti.com/lit/gpn/ucc27524>; ARROW_PART_NUMBER: UCC27524DR; ARROW_PRICE-STOCK: https://www.arrow.com/en/products/ucc27524dr/texas-instruments?region=nac; DESCRIPTION: Dual, 5A, High-Speed Low-Side Power MOSFET Driver; HEIGHT: 1.75mm; MANUFACTURER_NAME: Texas Instruments; MANUFACTURER_PART_NUMBER: UCC27524DR; MOUSER_PART_NUMBER: 595-UCC27524DR; MOUSER_PRICE-STOCK: https://www.mouser.co.uk/ProductDetail/Texas-Instruments/UCC27524DR?qs=iuXUNOC6nYdK8rrTqka0jA%3D%3D
IC7 = SamacSys_Parts:MPU-6500: IMUs - Inertial Measurement Units 6-Axis MEMS MotionTracking Device with DMP Source: Datasheet <https://product.tdk.com/system/files/dam/doc/product/sensor/mortion-inertial/imu/data_sheet/mpu-6500-datasheet2.pdf>; ARROW_PART_NUMBER: MPU-6500; ARROW_PRICE-STOCK: https://www.arrow.com/en/products/mpu-6500/invensense?region=nac; DESCRIPTION: IMUs - Inertial Measurement Units 6-Axis MEMS MotionTracking Device with DMP; HEIGHT: 0.95mm; MANUFACTURER_NAME: TDK; MANUFACTURER_PART_NUMBER: MPU-6500; MOUSER_PART_NUMBER: 410-MPU-6500; MOUSER_PRICE-STOCK: https://www.mouser.co.uk/ProductDetail/TDK-InvenSense/MPU-6500?qs=u4fy%2FsgLU9PiIOIlWOSPhQ%3D%3D
IC8 = SamacSys_Parts:TPS61088RHLT: Texas Instruments TPS61088RHLT, 3, Boost Converter, Synchronous Boost Converter 10A 4.5 12.6 V, 2.2 MHz 20-Pin Source: Datasheet <http://www.ti.com/lit/ds/symlink/tps61088.pdf>; ARROW_PART_NUMBER: TPS61088RHLT; ARROW_PRICE-STOCK: https://www.arrow.com/en/products/tps61088rhlt/texas-instruments?region=nac; DESCRIPTION: Texas Instruments TPS61088RHLT, 3, Boost Converter, Synchronous Boost Converter 10A 4.5 12.6 V, 2.2 MHz 20-Pin; HEIGHT: 1mm; MANUFACTURER_NAME: Texas Instruments; MANUFACTURER_PART_NUMBER: TPS61088RHLT; MOUSER_PART_NUMBER: 595-TPS61088RHLT; MOUSER_PRICE-STOCK: https://www.mouser.co.uk/ProductDetail/Texas-Instruments/TPS61088RHLT?qs=MiqG6Kq1qKOeAwvWtl5eUw%3D%3D
IC9 = SamacSys_Parts:STM32F405RGT6V: STMicroelectronics, STM32F405RGT6V STM32F405RGT6V, 32 bit ARM Cortex M4 MCU 168MHz 1024 kB Flash, 192 + 4 kB RAM, USB CAN I2C 64-Pin LQFP Source: Datasheet <http://www.st.com/web/en/resource/technical/document/datasheet/DM00037051.pdf>; ARROW_PART_NUMBER: STM32F405RGT6V; ARROW_PRICE-STOCK: https://www.arrow.com/en/products/stm32f405rgt6v/stmicroelectronics?region=nac; DESCRIPTION: STMicroelectronics, STM32F405RGT6V STM32F405RGT6V, 32 bit ARM Cortex M4 MCU 168MHz 1024 kB Flash, 192 + 4 kB RAM, USB CAN I2C 64-Pin LQFP; HEIGHT: 1.6mm; MANUFACTURER_NAME: STMicroelectronics; MANUFACTURER_PART_NUMBER: STM32F405RGT6V; MOUSER_PART_NUMBER: 511-STM32F405RGT6V; MOUSER_PRICE-STOCK: https://www.mouser.co.uk/ProductDetail/STMicroelectronics/STM32F405RGT6V?qs=gNDSiZmRJS%2FlL0isCSU2mg%3D%3D
J1 = Connector:B2B-XH-A: XH Connector Top Entry - 2POS Details see: Datasheet <http://www.jst-mfg.com/product/pdf/eng/eXH.pdf>; CATEGORY: CONNECTOR; DESCRIPTION: 2.5mm pitch/disconnectable crimp style connector; MANUFACTURER: JST (XH CONNECTOR); MPN: B2B-XH-A; OPERATING_TEMPERATURE: -25°C ~ 85°C; PART_STATUS: ACTIVE; ROHS_COMPLIANT: COMPLIANT; SERIES: B_B-XH-A; SPICEPREFIX: B; SUB_CATEGORY: Through hole connector; TYPE: top entry
J2 J3 = con-lstb:MA03-2: PIN HEADER; OC_FARNELL: unknown; OC_NEWARK: unknown
J4 = SparkFun-Connectors:CONN_04X2: Multi connection point. Often used as Generic Header-pin footprint for 0.1 inch spaced/style header connections On any of the 0.1 inch spaced packages, you can populate with these: Break Away Headers - Straight <https://www.sparkfun.com/products/116> (PRT-00116) Break Away Male Headers - Right Angle <https://www.sparkfun.com/products/553> (PRT-00553) Female Headers <https://www.sparkfun.com/products/115> (PRT-00115) Break Away Headers - Machine Pin <https://www.sparkfun.com/products/117> (PRT-00117) Break Away Female Headers - Swiss Machine Pin <https://www.sparkfun.com/products/743> (PRT-00743)
JP1 JP2 = jumper:JP1Q: JUMPER
JP3 = adafruit:PINHD-1X6: PIN HEADER
L1 L3 L6 = Inductor:L: Inductor Fixed - Generic; CATEGORY: Inductor; SUB-CATEGORY: Fixed
L2 L4 L5 L7 XFL4020 = rcl:L-US: INDUCTOR, American symbol; SPICEPREFIX: L
LS1 = SamacSys_Parts:SMT-0540-S-R: Speakers & Transducers SMD TRANSDUCER 3VP-P 100MA Source: Datasheet <http://www.puiaudio.com/pdf/SMT-0540-S-R.pdf>; DESCRIPTION: Speakers & Transducers SMD TRANSDUCER 3VP-P 100MA; HEIGHT: 2mm; MANUFACTURER_NAME: PUI Audio; MANUFACTURER_PART_NUMBER: SMT-0540-S-R; MOUSER_PART_NUMBER: 665-SMT0540SR; MOUSER_PRICE-STOCK: https://www.mouser.co.uk/ProductDetail/PUI-Audio/SMT-0540-S-R?qs=e16JbV5WBEu5VaDVzQP23Q%3D%3D
PWR_LED1 = adafruit:LED: LED OSRAM: - CHIPLED LG R971, LG N971, LY N971, LG Q971, LY Q971, LO R971, LY R971 LH N974, LH R974 LS Q976, LO Q976, LY Q976 LO Q996 - Hyper CHIPLED LW Q18S LB Q993, LB Q99A, LB R99A - SideLED LS A670, LO A670, LY A670, LG A670, LP A670 LB A673, LV A673, LT A673, LW A673 LH A674 LY A675 LS A676, LA A676, LO A676, LY A676, LW A676 LS A679, LY A679, LG A679 - Hyper Micro SIDELED® LS Y876, LA Y876, LO Y876, LY Y876 LT Y87S - SmartLED LW L88C, LW L88S LB L89C, LB L89S, LG L890 LS L89K, LO L89K, LY L89K LS L896, LA L896, LO L896, LY L896 - TOPLED LS T670, LO T670, LY T670, LG T670, LP T670 LSG T670, LSP T670, LSY T670, LOP T670, LYG T670 LG T671, LOG T671, LSG T671 LB T673, LV T673, LT T673, LW T673 LH T674 LS T676, LA T676, LO T676, LY T676, LB T676, LH T676, LSB T676, LW T676 LB T67C, LV T67C, LT T67C, LS T67K, LO T67K, LY T67K, LW E67C LS E67B, LA E67B, LO E67B, LY E67B, LB E67C, LV E67C, LT E67C LW T67C LS T679, LY T679, LG T679 LS T770, LO T770, LY T770, LG T770, LP T770 LB T773, LV T773, LT T773, LW T773 LH T774 LS E675, LA E675, LY E675, LS T675 LS T776, LA T776, LO T776, LY T776, LB T776 LHGB T686 LT T68C, LB T68C - Hyper Mini TOPLED® LB M676 - Mini TOPLED Santana® LG M470 LS M47K, LO M47K, LY M47K Source: http://www.osram.convergy.de/; SPICEPREFIX: B
Q1 Q2 = ZXMHC3F381N8TC:ZXMHC3F381N8TC: MOSFET Dual N/P-Ch 30V 4.98A/4.13A SOIC8 Diodes Inc ZXMHC3F381N8TC Quad N/P-channel MOSFET Transistor, 8-Pin SO Source: Datasheet <https://www.diodes.com/assets/Datasheets/ZXMHC3F381N8.pdf>; ARROW_PART_NUMBER: ZXMHC3F381N8TC; ARROW_PRICE-STOCK: https://www.arrow.com/en/products/zxmhc3f381n8tc/diodes-incorporated?region=nac; DESCRIPTION: MOSFET Dual N/P-Ch 30V 4.98A/4.13A SOIC8 Diodes Inc ZXMHC3F381N8TC Quad N/P-channel MOSFET Transistor, 8-Pin SO; HEIGHT: 1.75mm; MANUFACTURER_NAME: Diodes Inc.; MANUFACTURER_PART_NUMBER: ZXMHC3F381N8TC; MOUSER_PART_NUMBER: 522-ZXMHC3F381N8TC; MOUSER_PRICE-STOCK: https://www.mouser.co.uk/ProductDetail/Diodes-Incorporated/ZXMHC3F381N8TC?qs=7E5rbXJDVJoJr15tcLBfrA%3D%3D
Q3 Q4 Q6 Q8 Q9 = SamacSys_Parts:TEFT4300: Vishay TEFT4300 60 Infrared Phototransistor, Through-hole 3mm Package Source: Datasheet <https://datasheet.datasheetarchive.com/originals/distributors/Datasheets-310/86913.pdf>; ARROW_PART_NUMBER: TEFT4300; ARROW_PRICE-STOCK: https://www.arrow.com/en/products/teft4300/vishay; DESCRIPTION: Vishay TEFT4300 60 Infrared Phototransistor, Through-hole 3mm Package; HEIGHT: 6.1mm; MANUFACTURER_NAME: Vishay; MANUFACTURER_PART_NUMBER: TEFT4300; MOUSER_PART_NUMBER: 782-TEFT4300; MOUSER_PRICE-STOCK: https://www.mouser.co.uk/ProductDetail/Vishay-Semiconductors/TEFT4300?qs=HsFHTXumnCRbcrt8oPFPMA%3D%3D
Q10-Q15 Q18-Q21 = SamacSys_Parts:SSM3K324R: MOSFET N-Ch 4A SOT-23F-3 Source: Datasheet <https://toshiba.semicon-storage.com/info/docget.jsp?did=13880&prodName=SSM3K324R>; DESCRIPTION: MOSFET N-Ch 4A SOT-23F-3; HEIGHT: 0.88mm; MANUFACTURER_NAME: Toshiba; MANUFACTURER_PART_NUMBER: SSM3K324R
R_B1-R_B5 R_FBB2 R_FBT1 R_LED1 R_LED1_PULLUP R_LED1_PULLUP1-R_LED1_PULLUP3 R_LED2-R_LED4 R_LED6-R_LED9 R_PG1 R_PWMUP3 R_PWMUP4 R_PWMUP_1 R_PWMUP_2 R_PWR1 R_R1 R_R2 R_R4 R_R6-R_R18 R_VM1 R_VM2 RB1 = Resistor:R: Resistor Fixed - Generic; CATEGORY: Resistor; SPICEPREFIX: R; SUB-CATEGORY: Fixed
RT1 = rcl:R-EU_: RESISTOR, European symbol; SPICEPREFIX: R
S1 S3 = SamacSys_Parts:KMR211G: Tactile Switch SPST-NO Top Actuated Surface Mount, Microminiature 40 N (8.8 lbs) during 25,000 cycles Source: Datasheet <https://pdf1.alldatasheet.com/datasheet-pdf/view/160540/ITT/KMR211G.html>; DESCRIPTION: Tactile Switch SPST-NO Top Actuated Surface Mount, Microminiature 40 N (8.8 lbs) during 25,000 cycles; HEIGHT: 1.9mm; MANUFACTURER_NAME: ITT CANNON; MANUFACTURER_PART_NUMBER: KMR211G
S2 = SparkFun-Switches:SWITCH-SPDT: Single Pole, Double Throw (SPDT) Switch Single-pole, double-throw (SPDT) switch. Variant Overview SMD-AYZ0202 Surface Mount DPDT Switch <https://www.sparkfun.com/products/597> (COM-00597) Used on e.g. LilyPad Arduino USB - ATmega32U4 Board <https://www.sparkfun.com/products/12049> PTH-11.6X4.0MM SPDT Mini Power Switch <https://www.sparkfun.com/products/102> (COM-00102) Used on e.g. SparkFun Simon Says - Through-Hole Soldering Kit <https://www.sparkfun.com/products/10547> (KIT-10547) PTH-11.6X4.0MM-KIT KIT version of SPDT Mini Power Switch - Simplifies soldering by removing tStop of switch pins - only one side can be soldered. PTH-11.6X4.0MM-LOCK LOCK version of SPDT Mini Power Switch - Offset pins hold switch in place for easier soldering. SMD-RIGHT-ANGLE Surface Mount Right Angle Switch <https://www.sparkfun.com/products/10860> (COM-10860) Used on e.g. SparkFun ESP8266 Thing <https://www.sparkfun.com/products/13231>; PROD_ID: SWCH-08261; SF_SKU: COM-00102

## Module P1
Ports: 

### Library data of the parts